# Altium project LoraSMS.PrjPcb
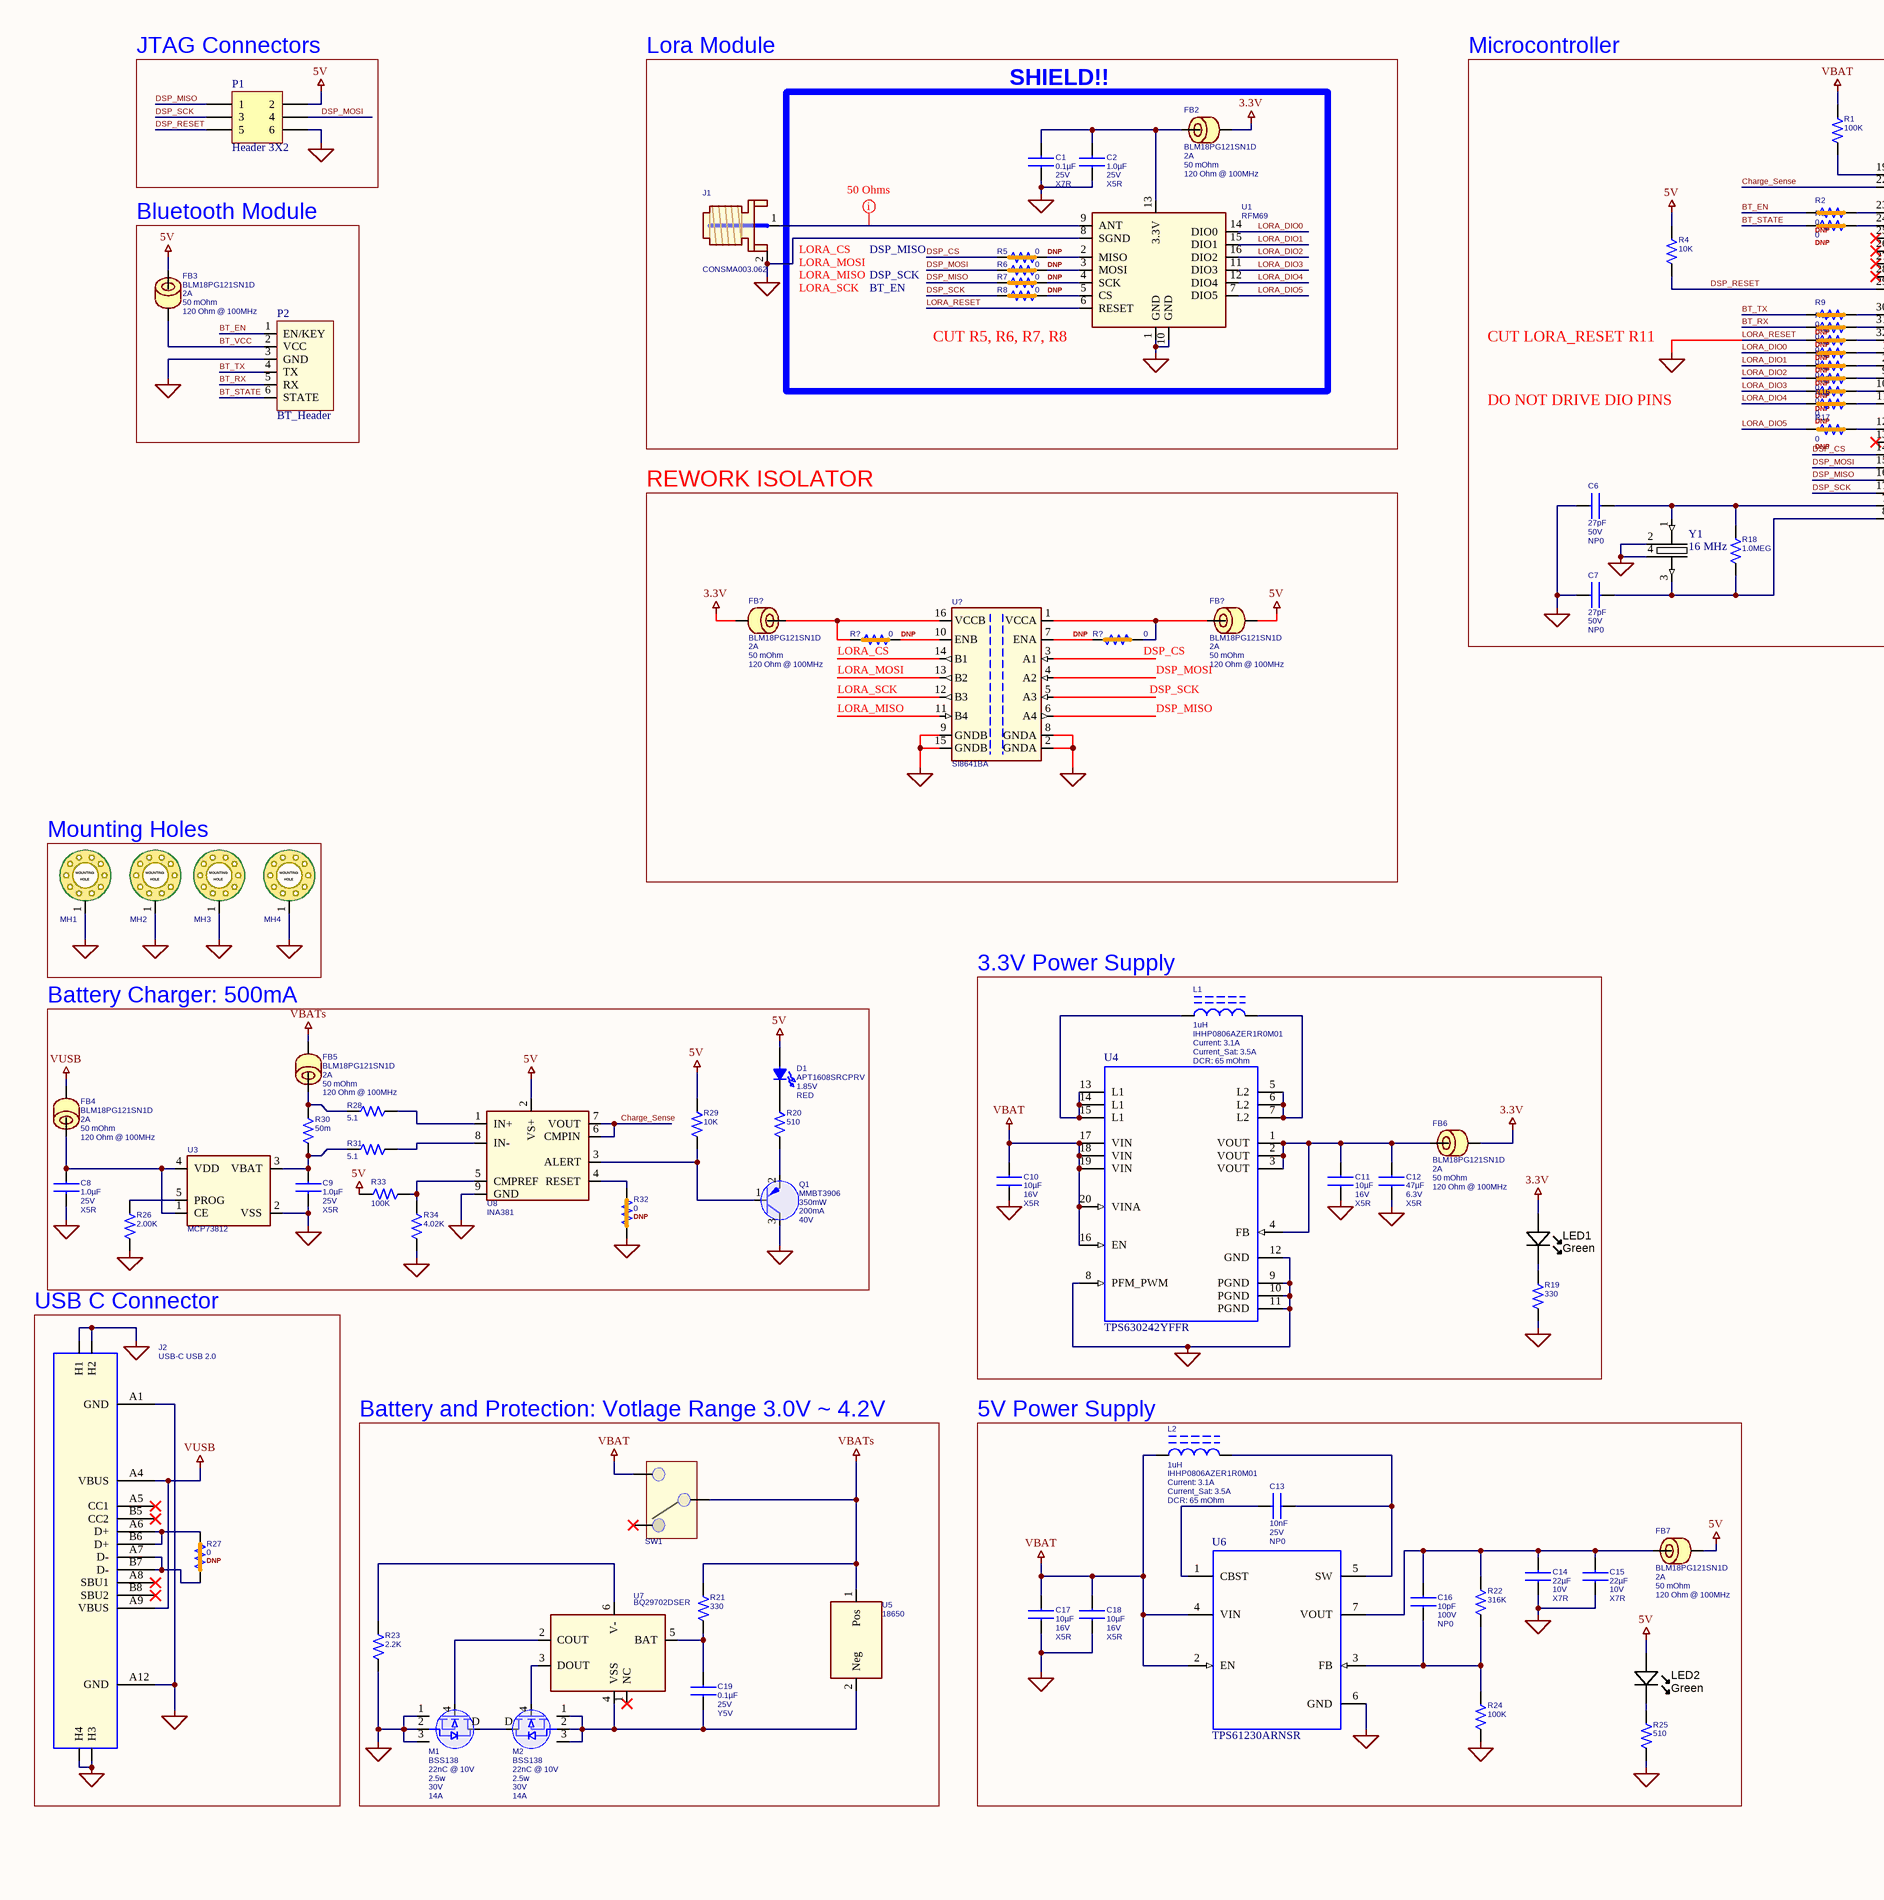
[diagram p0: 01 - Main.SchDoc, left]
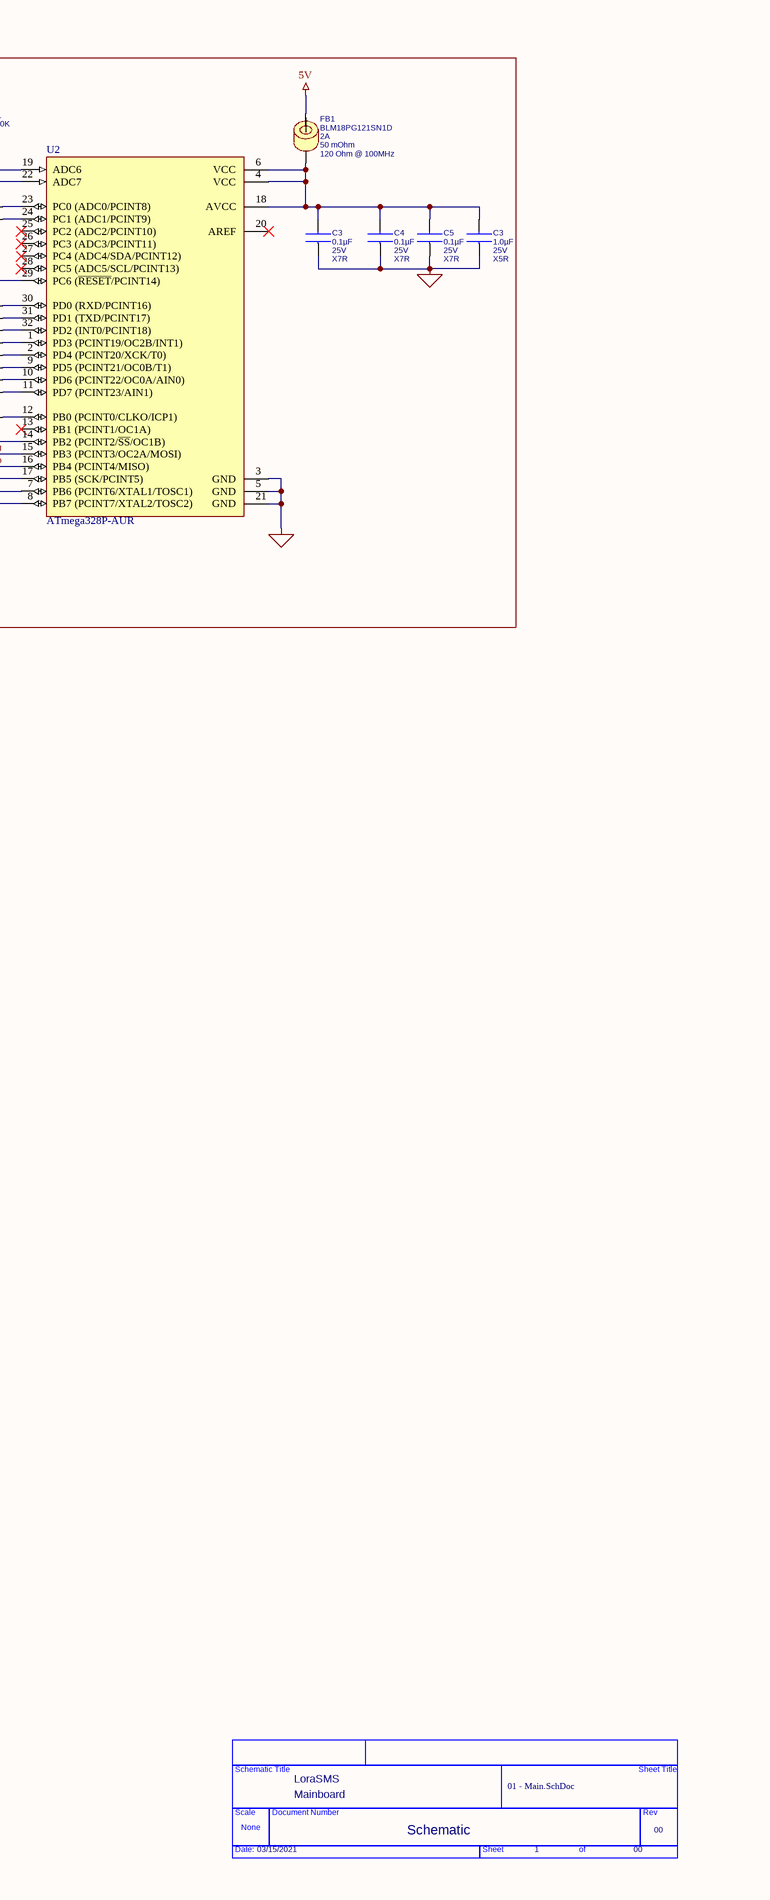
[diagram p1: 01 - Main.SchDoc, right]
prj_par_Project_Name: LoraSMS; prj_par_PCB_Name: Mainboard; prj_par_360_REV: 00; prj_par_360_ReleaseDate: 03/15/2021; prj_par_360_AviPrtNum: 360-XXXXX-XXX(set in Prj Parameters); prj_par_350_REV: 00; prj_par_350_ReleaseDate: 03/15/2021; prj_par_350_AviPrtNum: Fabrication; prj_par_340_REV: 00; prj_par_340_ReleaseDate: 03/15/2021; prj_par_340_AviPrtNum: PCB; prj_par_330_Sheet_Total: 00; prj_par_330_REV: 00; prj_par_330_ReleaseDate: 03/15/2021; prj_par_330_AviPrtNum: Schematic; prj_par_310_REV: 00; prj_par_310_ReleaseDate: 03/15/2021; prj_par_310_AviPrtNum: Assembly
1 sheet, 93 parts. Net scope: flat (ports and power ports of the same name join across sheets).
Board file: LoraSMS.PcbDoc

## Sheet 01 - Main.SchDoc: SetInProjOptions
size 513 x 386 mm; Date: SetInProjOptions; DocumentNumber: SetInProjOptions; Revision: SetInProjOptions; SheetNumber: 1; SheetTotal: SetInProjOptions; CurrentDate: SetInProjOptions; ProjectName: SetInProjOptions

### Parts
(Parts that share a designator on the sheet are numbered #1, #2 ... from top to bottom, then left to right.)
*?  R_E_V: 00  P_C_B_Name: Mainboard  Proj_Name: LoraSMS  SheetTitle: 01 - Main.SchDoc  Page Number: 1  Doc: Schematic  (graphical)
C1  0.1µF  VOLTAGE: 25V  DIELECTRIC: X7R  [CAPC1608X95N]
C2  1.0µF  VOLTAGE: 25V  DIELECTRIC: X5R  [CAPC1608X95N]
C3#1  0.1µF  VOLTAGE: 25V  DIELECTRIC: X7R  [CAPC1608X95N]
C3#2  1.0µF  VOLTAGE: 25V  DIELECTRIC: X5R  [CAPC1608X95N]
C4  0.1µF  VOLTAGE: 25V  DIELECTRIC: X7R  [CAPC1608X95N]
C5  0.1µF  VOLTAGE: 25V  DIELECTRIC: X7R  [CAPC1608X95N]
C6  27pF  VOLTAGE: 50V  DIELECTRIC: NP0  [CAPC1608X95N]
C7  27pF  VOLTAGE: 50V  DIELECTRIC: NP0  [CAPC1608X95N]
C8  1.0µF  VOLTAGE: 25V  DIELECTRIC: X5R  [CAPC1608X95N]
C9  1.0µF  VOLTAGE: 25V  DIELECTRIC: X5R  [CAPC1608X95N]
C10  10µF  VOLTAGE: 16V  DIELECTRIC: X5R  [CAPC2013X140N]
C11  10µF  VOLTAGE: 16V  DIELECTRIC: X5R  [CAPC2013X140N]
C12  47µF  VOLTAGE: 6.3V  DIELECTRIC: X5R  [CAPC2013X140N]
C13  10nF  VOLTAGE: 25V  DIELECTRIC: NP0  [CAPC1608X95N]
C14  22µF  VOLTAGE: 10V  DIELECTRIC: X7R  [CAPC2013X140N]
C15  22µF  VOLTAGE: 10V  DIELECTRIC: X7R  [CAPC2013X140N]
C16  10pF  VOLTAGE: 100V  DIELECTRIC: NP0  [CAPC1608X95N]
C17  10µF  VOLTAGE: 16V  DIELECTRIC: X5R  [CAPC2013X140N]
C18  10µF  VOLTAGE: 16V  DIELECTRIC: X5R  [CAPC2013X140N]
C19  0.1µF  VOLTAGE: 25V  DIELECTRIC: Y5V  [CAPC1608X95N]
D1  APT1608SRCPRV  Vf: 1.85V  LED_COLOR: RED  [LEDM1608X90N]
FB1  BLM18PG121SN1D  Current: 2A  DCR: 50 mOhm  Impedance: 120 Ohm @ 100MHz  [INDC1608X95N]
FB2  BLM18PG121SN1D  Current: 2A  DCR: 50 mOhm  Impedance: 120 Ohm @ 100MHz  [INDC1608X95N]
FB3  BLM18PG121SN1D  Current: 2A  DCR: 50 mOhm  Impedance: 120 Ohm @ 100MHz  [INDC1608X95N]
FB4  BLM18PG121SN1D  Current: 2A  DCR: 50 mOhm  Impedance: 120 Ohm @ 100MHz  [INDC1608X95N]
FB5  BLM18PG121SN1D  Current: 2A  DCR: 50 mOhm  Impedance: 120 Ohm @ 100MHz  [INDC1608X95N]
FB6  BLM18PG121SN1D  Current: 2A  DCR: 50 mOhm  Impedance: 120 Ohm @ 100MHz  [INDC1608X95N]
FB7  BLM18PG121SN1D  Current: 2A  DCR: 50 mOhm  Impedance: 120 Ohm @ 100MHz  [INDC1608X95N]
FB?#1  BLM18PG121SN1D  Current: 2A  DCR: 50 mOhm  Impedance: 120 Ohm @ 100MHz  [INDC1608X95N]
FB?#2  BLM18PG121SN1D  Current: 2A  DCR: 50 mOhm  Impedance: 120 Ohm @ 100MHz  [INDC1608X95N]
J1  CONSMA003.062  [LINX_CONSMA003.062]
J2  USB-C USB 2.0  [GCT_USB4110-GF-A]
L1  1uH  Manufacturer P/N: IHHP0806AZER1R0M01  Current: 3.1A  Current_Sat: 3.5A  DCR: 65 mOhm  [INDC2016X10N]
L2  1uH  Manufacturer P/N: IHHP0806AZER1R0M01  Current: 3.1A  Current_Sat: 3.5A  DCR: 65 mOhm  [INDC2016X10N]
LED1  Green  [LED-0603-GREEN]
LED2  Green  [LED-0603-GREEN]
M1  BSS138  Qg: 22nC @ 10V  Wattage: 2.5w  Vdss: 30V  Id: 14A  [VISHAY_POWERPAK-SO-8-SINGLE]
M2  BSS138  Qg: 22nC @ 10V  Wattage: 2.5w  Vdss: 30V  Id: 14A  [VISHAY_POWERPAK-SO-8-SINGLE]
MH1  MOUNTING HOLE  [MHOLE-120-280]  (value not drawn)
MH2  MOUNTING HOLE  [MHOLE-120-280]  (value not drawn)
MH3  MOUNTING HOLE  [MHOLE-120-280]  (value not drawn)
MH4  MOUNTING HOLE  [MHOLE-120-280]  (value not drawn)
P1  Header 3X2  [HDR2X3]
P2  BT_Header  [BT_MODULE]
Q1  MMBT3906  Wattage: 350mW  Current: 200mA  Voltage: 40V  [SOT95P240X115-3N]
R1  100K  [RESC1608X84N]
R2  0  Do Not Populate: DNP  [RESC1005X40N_SHORT]  (net tie)
R3  0  Do Not Populate: DNP  [RESC1005X40N_SHORT]  (net tie)
R4  10K  [RESC1608X84N]
R5  0  Do Not Populate: DNP  [RESC1005X40N_SHORT]  (net tie)
R6  0  Do Not Populate: DNP  [RESC1005X40N_SHORT]  (net tie)
R7  0  Do Not Populate: DNP  [RESC1005X40N_SHORT]  (net tie)
R8  0  Do Not Populate: DNP  [RESC1005X40N_SHORT]  (net tie)
R9  0  Do Not Populate: DNP  [RESC1005X40N_SHORT]  (net tie)
R10  0  Do Not Populate: DNP  [RESC1005X40N_SHORT]  (net tie)
R11  0  Do Not Populate: DNP  [RESC1005X40N_SHORT]  (net tie)
R12  0  Do Not Populate: DNP  [RESC1005X40N_SHORT]  (net tie)
R13  0  Do Not Populate: DNP  [RESC1005X40N_SHORT]  (net tie)
R14  0  Do Not Populate: DNP  [RESC1005X40N_SHORT]  (net tie)
R15  0  Do Not Populate: DNP  [RESC1005X40N_SHORT]  (net tie)
R16  0  Do Not Populate: DNP  [RESC1005X40N_SHORT]  (net tie)
R17  0  Do Not Populate: DNP  [RESC1005X40N_SHORT]  (net tie)
R18  1.0MEG  [RESC1608X84N]
R19  330  [RESC2013X84N]
R20  510  [RESC1608X84N]
R21  330  [RESC1608X84N]
R22  316K  [RESC1608X84N]
R23  2.2K  [RESC1608X84N]
R24  100K  [RESC1608X84N]
R25  510  [RESC1608X84N]
R26  2.00K  [RESC1608X84N]
R27  0  Do Not Populate: DNP  [RESC1005X40N_SHORT]  (net tie)
R28  5.1  [RESC1608X84N]
R29  10K  [RESC1608X84N]
R30  50m  [RESC3216X84N]
R31  5.1  [RESC1608X84N]
R32  0  Do Not Populate: DNP  [RESC1005X40N_SHORT]  (net tie)
R33  100K  [RESC1608X84N]
R34  4.02K  [RESC1608X84N]
R?#1  0  Do Not Populate: DNP  [RESC1005X40N_SHORT]  (net tie)
R?#2  0  Do Not Populate: DNP  [RESC1005X40N_SHORT]  (net tie)
SW1  SWITCH  [JS202011JAQN]  (value not drawn)
U1  RFM69  [RFM69HCW]
U2  ATmega328P-AUR  [32A_N]
U3  MCP73812  [SOT95P280X145-5N]
U4  TPS630242YFFR  [YFF0020AEBA]
U5  18650  [18650]
U6  N/A  [RNS0007A]  (value not drawn)
U7  BQ29702DSER  [SOTFL50P162X60-6N]
U8  INA381  [SON45P200X200X80-9N]
U?  SI8641BA
Y1  16 MHz  [Crystal_2.5x2.0]

### Blocks framed on the sheet
JTAG Connectors: P1
Lora Module: J1
Microcontroller: C3#1 C3#2 C4-C7 FB1 R1-R4 R9-R18 U2 Y1
SHIELD!!: C1 C2 FB2 R5-R8 U1
Bluetooth Module: FB3 P2
REWORK ISOLATOR: FB?#1 FB?#2 R?#1 R?#2 U?
Mounting Holes: MH1-MH4
3.3V Power Supply: C10-C12 FB6 L1 LED1 R19 U4
Battery Charger: 500mA: C8 C9 D1 FB4 FB5 Q1 R20 R26 R28-R34 U3 U8
USB C Connector: J2 R27
Battery and Protection: Votlage Range 3.0V ~ 4.2V: C19 M1 M2 R21 R23 SW1 U5 U7
5V Power Supply: C13-C18 FB7 L2 LED2 R22 R24 R25 U6

### Nets
3.3V: FB2.2 FB6.2 FB?#1.2 LED1.A
5V: D1.A(ANODE) FB1.1 FB3.1 FB7.2 FB?#2.2 LED2.A P1.2 R4.1 R29.1 R33.1 U8.2(VS+)
GND: C1.2 C2.2 C3#1.2 C3#2.2 C4.2 C5.2 C6.1 C7.1 C8.2 C9.2 C10.2 C11.2 C12.2 C14.2 C15.2 C17.2 C18.2 J1.2(SHIELD) J2.A1(GND) J2.A12(GND) J2.H1 J2.H2 J2.H3 J2.H4 M1.1(SOURCE) M1.2(SOURCE) M1.3(SOURCE) MH1.1 MH2.1 MH3.1 MH4.1 P1.6 P2.3(GND) Q1.3(C) R19.2 R23.2 R24.2 R25.2 R26.2 R32.1 R34.2 U1.1(GND) U1.8(SGND) U1.10(GND) U2.3(GND) U2.5(GND) U2.21(GND) U3.2(VSS) U4.8(PFM_PWM) U4.9(PGND) U4.10(PGND) U4.11(PGND) U4.12(GND) U6.6(GND) U8.9(GND) U?.2(GNDA) U?.8(GNDA) U?.9(GNDB) U?.15(GNDB) Y1.2(GND) Y1.4(GND)
VBAT: C10.1 C17.1 C18.1 L2.1 R1.1 SW1.1 U4.16(EN) U4.17(VIN) U4.18(VIN) U4.19(VIN) U4.20(VINA) U6.2(EN) U6.4(VIN)
VBATs: FB5.2 R21.1 SW1.2 U5.1(Pos)
VUSB: FB4.2 J2.A4(VBUS) J2.A9(VBUS)
BT_EN: P2.1(EN/KEY) R2.1
BT_RX: P2.5(RX) R10.1
BT_STATE: P2.6(STATE) R3.1
BT_TX: P2.4(TX) R9.1
BT_VCC: FB3.2 P2.2(VCC)
Charge_Sense: U2.22(ADC7) U8.6(CMPIN) U8.7(VOUT)
DSP_CS: R5.1 U2.14(PB2_(PCINT2/~{SS}/OC1B))
DSP_MISO: P1.1 R7.1 U2.16(PB4_(PCINT4/MISO))
DSP_MOSI: P1.4 R6.1 U2.15(PB3_(PCINT3/OC2A/MOSI))
DSP_RESET: P1.5 R4.2 U2.29(PC6_(~{RESET}/PCINT14))
DSP_SCK: P1.3 R8.1 U2.17(PB5_(SCK/PCINT5))
LORA_DIO0: R12.1 U1.14(DIO0)
LORA_DIO1: R13.1 U1.15(DIO1)
LORA_DIO2: R14.1 U1.16(DIO2)
LORA_DIO3: R15.1 U1.11(DIO3)
LORA_DIO4: R16.1 U1.12(DIO4)
LORA_DIO5: R17.1 U1.7(DIO5)
LORA_RESET: R11.1 U1.6(RESET)
NetC1_1: C1.1 C2.1 FB2.1 U1.13(3.3V)
NetC3#1_1: C3#1.1 C3#2.1 C4.1 C5.1 FB1.2 U2.4(VCC) U2.6(VCC) U2.18(AVCC)
NetC6_2: C6.2 R18.1 U2.7(PB6_(PCINT6/XTAL1/TOSC1)) Y1.1
NetC7_2: C7.2 R18.2 U2.8(PB7_(PCINT7/XTAL2/TOSC2)) Y1.3
NetC8_1: C8.1 FB4.1 U3.1(CE) U3.4(VDD)
NetC9_1: C9.1 R30.2 R31.1 U3.3(VBAT)
NetC11_1: C11.1 C12.1 FB6.1 U4.1(VOUT) U4.2(VOUT) U4.3(VOUT) U4.4(FB)
NetC13_1: C13.1 U6.1(CBST)
NetC13_2: C13.2 L2.2 U6.5(SW)
NetC14_1: C14.1 C15.1 C16.1 FB7.1 R22.1 U6.7(VOUT)
NetC16_2: C16.2 R22.2 R24.1 U6.3(FB)
NetC19_1: C19.1 R21.2 U7.5(BAT)
NetC19_2: C19.2 M2.1(SOURCE) M2.2(SOURCE) M2.3(SOURCE) U5.2(Neg) U7.4(VSS)
NetD1_C: D1.C(CATHODE) R20.1
NetFB5_1: FB5.1 R28.1 R30.1
NetFB?#1_1: FB?#1.1 R?#1.1 U?.16(VCCB)
NetFB?#2_1: FB?#2.1 R?#2.1 U?.1(VCCA)
NetJ1_1: J1.1(CENTER) U1.9(ANT)
NetJ2_A6: J2.A6(D+) J2.B6(D+) R27.2
NetJ2_A7: J2.A7(D-) J2.B7(D-) R27.1
NetL1_1: L1.1 U4.13(L1) U4.14(L1) U4.15(L1)
NetL1_2: L1.2 U4.5(L2) U4.6(L2) U4.7(L2)
NetLED1_K: LED1.K R19.1
NetLED2_K: LED2.K R25.1
NetM1_4: M1.4(GATE) U7.2(COUT)
NetM1_D: M1.D(DRAIN) M2.D(DRAIN)
NetM2_4: M2.4(GATE) U7.3(DOUT)
NetQ1_1: Q1.1(B) R29.2 U8.3(ALERT)
NetQ1_2: Q1.2(E) R20.2
NetR1_2: R1.2 U2.19(ADC6)
NetR2_2: R2.2 U2.23(PC0_(ADC0/PCINT8))
NetR3_2: R3.2 U2.24(PC1_(ADC1/PCINT9))
NetR5_2: R5.2 U1.2(MISO)
NetR6_2: R6.2 U1.3(MOSI)
NetR7_2: R7.2 U1.4(SCK)
NetR8_2: R8.2 U1.5(CS)
NetR9_2: R9.2 U2.30(PD0_(RXD/PCINT16))
NetR10_2: R10.2 U2.31(PD1_(TXD/PCINT17))
NetR11_2: R11.2 U2.32(PD2_(INT0/PCINT18))
NetR12_2: R12.2 U2.1(PD3_(PCINT19/OC2B/INT1))
NetR13_2: R13.2 U2.2(PD4_(PCINT20/XCK/T0))
NetR14_2: R14.2 U2.9(PD5_(PCINT21/OC0B/T1))
NetR15_2: R15.2 U2.10(PD6_(PCINT22/OC0A/AIN0))
NetR16_2: R16.2 U2.11(PD7_(PCINT23/AIN1))
NetR17_2: R17.2 U2.12(PB0_(PCINT0/CLKO/ICP1))
NetR23_1: R23.1 U7.6(V-)
NetR26_1: R26.1 U3.5(PROG)
NetR28_2: R28.2 U8.1(IN+)
NetR31_2: R31.2 U8.8(IN-)
NetR32_2: R32.2 U8.4(RESET)
NetR33_2: R33.2 R34.1 U8.5(CMPREF)
NetR?#1_2: R?#1.2 U?.10(ENB)
NetR?#2_2: R?#2.2 U?.7(ENA)

Not connected (* = marked no-connect by the designer): J2 A5(CC1)* A8(SBU1)* B5(CC2)* B8(SBU2)*; SW1 3*; U2 13(PB1_(PCINT1/OC1A))* 20(AREF)* 25(PC2_(ADC2/PCINT10))* 26(PC3_(ADC3/PCINT11))* 27(PC4_(ADC4/SDA/PCINT12))* 28(PC5_(ADC5/SCL/PCINT13))*; U7 1(NC)*; U? 3(A1) 4(A2) 5(A3) 6(A4) 11(B4) 12(B3) 13(B2) 14(B1)

### Layout directives
net class 50 Ohms: NetJ1_1

### Notes on the sheet
- (near J1) LORA_MOSI
- (near J1) LORA_MISO
- (near J1) LORA_SCK
- (near J1) LORA_CS
- DSP_MISO
- DSP_SCK
- BT_EN
- (near U1) CUT R5, R6, R7, R8
- CUT LORA_RESET R11
- DO NOT DRIVE DIO PINS
- (near R?#1) LORA_MOSI
- (near R?#1) LORA_CS
- (near R?#2) DSP_CS
- (near R?#2) DSP_MOSI
- LORA_MISO
- LORA_SCK
- Labels drawn without touching a wire or pin: GND
- (in symbol Fox_PrjLvl_TitleBlock) Schematic Title; Sheet Title; Scale; Document Number; Rev; None; Date:; Sheet; of
- (in symbol MHOLE-120-280) MOUNTING; HOLE

### Library data of the parts
*? = Fox_PrjLvl_TitleBlock: Page Create Date: May 8, 2017; Page Count: 00
C1 C3#1 C4 C5 = 060-00124-000: CAP, CER, SMT, 25V, +/- 10%, X7R, 0603; Manufacturer: Kemet Corporation; Manufacturer P/N: C0603C104K3RAC; Value (nF): 100; Value (pF): 100000; Value (µF): 0.1; Package: C0603; TOLERANCE: 10%; Value: 0.1µF; Cost: 0.0043
C2 C3#2 C8 C9 = 060-00192-001: CAP, CER, SMT, 1.0UF, 25V, 10%, X5R, 0603; Manufacturer: Kemet Corporation; Manufacturer P/N: C0603C105K3PAC; Value (nF): 1000; Value (pF): 1000000; Value (µF): 1; Package: C0603; TOLERANCE: 10%; Value: 1.0µF; Cost: 0.0145
C6 C7 = 060-00139-005: CAP, CER, 10%, 50V, 27PF, CAP0603; Manufacturer: Kemet Corporation; Manufacturer P/N: C0603C270K5GAC; Value (nF): 0.027; Value (pF): 27; Value (µF): 0.000027; Package: C0603; TOLERANCE: 10%; Value: 27pF; Cost: 0.01
C10 C11 C17 C18 = 060-00196-000: CAP, CER, 10UF, 16V, X5R, 0805; Manufacturer: Murata Manufacturing Co., Ltd.; Manufacturer P/N: GRM21BR61C106KE15L; TOLERANCE: 10%; Value (nF): 10000; Value (pF): 10000000; Value (µF): 10; Package: C0805; Value: 10µF; Cost: 0.0373
C12 = 060-00269-000: CAP, CER, 0805, 20%, 6.3V, X5R, 47UF; Manufacturer: Kemet Corporation; Manufacturer P/N: C0805C476M9PACTU; Value (nF): 47000; Value (pF): 47000000; Value (µF): 47; Package: C0805; TOLERANCE: 20%; Value: 47µF; Cost: 0.164
C13 = 060-00243-000: CAP, CER, 5%, 25V, C0G, 0603, 10,000PF; Manufacturer: TDK Corporation; Manufacturer P/N: C1608C0G1E103JT; Value (nF): 10; Value (pF): 10000; Value (µF): 0.01; Package: C0603; TOLERANCE: 5%; Value: 10nF; Cost: 0.2528
C14 C15 = 060-00268-000: CAP, CER, 0805, 20%, 10V, X7R, 22UF; Manufacturer: Taiyo Yuden USA, Inc.; Manufacturer P/N: LMK212BJ226MG-T; Value (nF): 22000; Value (pF): 22000000; Value (µF): 22; Package: C0805; TOLERANCE: 20%; Value: 22µF; Cost: 0.134
C16 = 064-00028-016: CAP RF, HIQ, NPO, +/-1%, 10GHZ, 200, 100V, 0603, 10PF, ROHS; Manufacturer: Vishay; Manufacturer P/N: VJ0603D100FXBA; TOLERANCE: 1%; Value (nF): 0.01; Value (pF): 10; Value (µF): 0.00001; Value: 10pF; Package: C0603; Cost: 0.18353
C19 = 060-00041-000: CAP, CER, SMT, 25V, +80/-20%,Y5V,0603,.1uf; Manufacturer: Kemet Corporation; Manufacturer P/N: C0603C104M3VAC; TOLERANCE: 20%; Value (nF): 100; Value (pF): 100000; Value (µF): 0.1; Package: C0603; Value: 0.1µF
D1 = 023-00316-000: DIODE, LED, RED, SMT, 2.5V, 0603; Manufacturer: Kingbright; Candela: 100mcd; Wattage: 75mW; Wavelength: 640nm; Current: 20mA; Manufacturer P/N: APT1608SRCPRV; Package: D0603; Value: APT1608SRCPRV; Type: LED; Voltage: 2.5V; Cost: 0.04
FB1-FB7 FB?#1 FB?#2 = 082-00014-004: FERRITE,100MHZ,0603,25%,120OHM ROHS; Manufacturer: Murata; Manufacturer P/N: BLM18PG121SN1D; Value: BLM18PG121SN1D; Package: L0603; Cost: 0.0172
J1 = 030-00761-000: CONN, SMA JACK, FEMALE, EDGE; Manufacturer: LINX; Manufacturer P/N: CONSMA003.062; Value: CONSMA003.062; Package: SMA; Cost: 3.37
J2 = USB4110-GF-A: CONN USB 2.0 TYPE-C R/A SMT; Manufacturer: GCT; Contacts: 24; Manufacturer P/N: USB4110-GF-A; Value: USB-C USB 2.0; Cost: 1.37; Pitch: *; Rows: *; Type: Female
L1 L2 = 080-00223-000: INDUCTOR POWER 1UH 1.5A SMD; Manufacturer: Vishay Dale; TOLERANCE: 20%; Value: 1uH; Package: 0.079" L x 0.063" W; Cost: 0.13
LED1 LED2 = LED_SMD_Green_0603_570nm: LED 0603 SMD Green 570nm 50mcd 20mA; Manufacturer 1: Kingbright Company LLC; Manufacturer Part Number 1: APT1608CGCK; Manufacturer: Wurth Electronics; Manufacturer P/N: 150060VS75000; Material: AlGaInP; Ratings: 20mcd min; 50 mcd typ; 570 nm; Voltage - Forward (Vf) Typ: 2.1V; Viewing Angle: 120°; Lens Style/Size: Rectangle with Flat Top, 1.1mm x 0.8mm; Voltage - Forward (Vf) @ 10mA: 2.0V; SCDType: source; Wavelength - Peak: 574nm; Lens Type: Clear; Package / Case: 0603 (1608 metric); Color: Green; Current - Test: 20mA; Supplier 1: Digi-Key; Supplier Part Number 1: 754-1116-1-ND; RoHS 1: RoHS Compliant; Wavelength - Dominant: 570nm; ComponentLink1URL: http://www.us.kingbright.com/images/catalog/SPEC/APT1608CGCK.pdf; ComponentLink1Description: http://www.us.kingbright.com/images/catalog/SPEC/APT1608CGCK.pdf
M1 M2 = FDMS7692: MOSFET N-CH 30V 14A POWER56; Manufacturer: ON Semiconductor; Rds(on): 7.5 Ohm; Vgs(th): 3V @ 250UA; Manufacturer P/N: FDMS7692; Value: BSS138; Type: NMOS; Cost: 0.62
MH1-MH4 = MHOLE-120-280: Value: MOUNTING HOLE
P1 = Header 3X2: Header, 3-Pin, Dual row; LatestRevisionDate: 17-Jul-2002; LatestRevisionNote: Re-released for DXP Platform.; Publisher: Altium Limited
P2 = BT_Header: HC-05 BLUETOOTH MODULE
Q1 = 025-00001-000: TRANS,BJT,PNP,3906,SOT-23; Manufacturer: Fairchild Semiconductor; Gain: 100 @ 10mA; Package: SOT-23; Value: MMBT3906; Manufacturer P/N: MMBT3906; Type: PNP; Cost: 0.012
R1 R24 = 070-00486-037: RES, THICK FILM CHIP, SMT, 1/10W, 1%, 0603, 100K OHM; Manufacturer: Panasonic Electronic Devices, Corp.; Manufacturer P/N: ERJ3EKF1003V; TOLERANCE: 1%; Value: 100K; Wattage: 1/10W; Package: R0603; Cost: 0.0016
R2 R3 R5-R17 R27 R32 R?#1 R?#2 = 070-00475-085_SHORT: RES, THICK FILM CHIP, 1/16W, 1%, RES0402, 0 OHM, ROHS, SHORT-IN-PAD!; Manufacturer: Vishay-Dale Intertechnology, Inc; Manufacturer P/N: CRCW04020000Z0ED; TOLERANCE: 1%; Value: 0; Wattage: 1/16W; Package: R0402; Cost: 0.0012
R4 R29 = 070-00470-014: RES, THICK FILM CHIP, SMT, 1/10W, 5%, 0603, 10K OHM; Manufacturer: Vishay-Dale Intertechnology, Inc; Manufacturer P/N: CRCW060310K0JNEA; TOLERANCE: 5%; Value: 10K; Wattage: 1/10W; Package: R0603
R18 = 070-00305-000: RES, 1/10W, 5%, 0603, I MEG; Manufacturer: KOA-Speer Electronics, Inc.; Manufacturer P/N: RM73B1JT105J; TOLERANCE: 5%; Value: 1.0MEG; Wattage: 1/10W; Package: R0603
R19 = 070-00072-000: RES, 1/8W, 5%, 0805, 330 OHM; Manufacturer: KOA-Speer Electronics, Inc.; Manufacturer P/N: RM73B2AT331J; TOLERANCE: 5%; Value: 330; Wattage: 1/8W; Package: R0805; Cost: 0.0019
R20 R25 = 070-00470-011: RES, THICK FILM CHIP, SMT, 1/10W, 5%, 0603, 510 OHM; Manufacturer: Panasonic Electronic Devices, Corp.; Manufacturer P/N: ERJ3GEYJ511V; TOLERANCE: 5%; Value: 510; Wattage: 1/10W; Package: R0603
R21 = 070-00442-000: RES, 1/16 W, 1%, 0603, 330 OHM; Manufacturer: Panasonic Electronic Devices, Corp.; Manufacturer P/N: ERJ-3ENF3300V; Wattage: 1/10W; TOLERANCE: 1%; Value: 330; Package: R0603
R22 = 070-00486-071: RES, THICK FILM CHIP, SMT, 1/10W, 1%, 0603, 316K OHM; Manufacturer: Panasonic Electronic Devices, Corp.; Manufacturer P/N: ERJ3EKF3163V; TOLERANCE: 1%; Value: 316K; Wattage: 1/10W; Package: R0603; Cost: 0.0016
R23 = 070-00208-000: RES, 1/10W, 5%, 0603, 2.2K OHM; Manufacturer: KOA-Speer Electronics, Inc.; Manufacturer P/N: RM73B1JT222J; TOLERANCE: 5%; Value: 2.2K; Wattage: 1/10W; Package: R0603; Cost: 0.0012
R26 = 070-00415-000: RES, 1/16W, 1%, 0603, 2.00K OHM; Manufacturer: Panasonic Electronic Devices, Corp.; Manufacturer P/N: ERJ-3EKF2001V; TOLERANCE: 1%; Value: 2.00K; Wattage: 1/16W; Package: R0603; Cost: 0.0032
R28 R31 = 070-00486-069: RES, THICK FILM CHIP, SMT, 1/10W, 1%, 0603, 5.1 OHM; Manufacturer: Panasonic Electronic Devices, Corp.; Manufacturer P/N: ERJ-3EKF5R1V; TOLERANCE: 1%; Value: 5.1; Wattage: 1/10W; Package: R0603
R30 = 070-00499-001: RES, THICK FILM, CURRENT SENSE, 1/2 W, 1%, RES1206, 0.05 OHMS; Manufacturer: TT Electronics, PLC; Manufacturer P/N: LRC-LR1206LF-01-R050-F; Wattage: 1/2W; TOLERANCE: 1%; Value: 50m; Package: R1206; Cost: 0.155
R33 = 070-00113-000: RES,1/10W,1%,0603,100K OHM; Manufacturer: Panasonic Electronic Devices, Corp.; Manufacturer P/N: ERJ-3EKF1003V; TOLERANCE: 1%; Value: 100K; Wattage: 1/10W; Package: R0603; Cost: 0.002
R34 = 070-00597-000: RES, METAL FILM, 1/16W, .5%, 0603, SMD, 4.02K; Manufacturer: Susumu; Manufacturer P/N: RR0816P-4021-D-59H; TOLERANCE: 1%; Value: 4.02K; Wattage: 1/16W; Package: R0603; Cost: 0.01178
SW1 = JS202011JAQN: SWITCH SLIDE DPDT 300MA 6V; Manufacturer P/N: C&K; Manufacturer: JS202011JAQN; Cost: 0.51
U1 = LoRa Module: RFM69HCW WIRELESS TRANSCEIVER 91; Manufacturer P/N: COM-13909; Manufacturer: SparkFun; Current: 130mA; Voltage-Input: 1.8V ~ 3.6V; Package: Module; Value: RFM69; Cost: 5.95
U2 = ATmega328P-AUR: 8-bit AVR Microcontroller, 32KB Flash, 1KB EEPROM, 2KB SRAM, 32-pin TQFP, Industrial Grade (-40°C to 85°C); Manufacturer: Microchip Technology; Manufacturer P/N: ATMEGA328PB-AU; Published: 1-Apr-2010; DatasheetVersion: revA, Jan-2010; PackageVersion: revB, Oct-2001; PackageReference: 32A; Publisher: Altium Limited; PackageDescription: 32-Lead, 7x7x1.0 mm Body, 0.8mm Lead Pitch, Thin Profile Plastic Quad Flat Package (TQFP); Supplier 1: Digi-Key; Supplier Part Number 1: ATMEGA328P-AUR-ND; Supplier 2: Mouser; Supplier Part Number 2: 556-ATMEGA328P-AUR; Code_JEDEC: MS-026-ABA; ComponentLink1Description: Manufacturer Link; ComponentLink1URL: http://www.atmel.com/products/avr/default.asp?; ComponentLink2Description: ATmega48A/48PA/88A/88PA/168A/168PA/328/328P Datasheet; ComponentLink2URL: http://www.atmel.com/dyn/resources/prod_documents/8271.pdf; ComponentLink3Description: ATmega48A/48PA/88A/88PA/168A/168PA/328/328P Summary; ComponentLink3URL: http://www.atmel.com/dyn/resources/prod_documents/8271S.pdf; ComponentLink4Description: Atmel.com Home; ComponentLink4URL: http://www.atmel.com
U3 = MCP73812: IC LI-ION/LI-POLY CTRLR SOT23-5; Manufacturer P/N: MCP73812T-420I/OT; Manufacturer: Microchip Technology; Current: 500mA; Voltage-Input: 3.75V ~ 6V; Package: SC-74A, SOT-753; Value: MCP73812; Cost: 0.56
U4 = TPS630242YFFR: Manufacturer Name: Texas Instruments; Manufacturer: TI; PackageReference: TPS630242YFFR; Manufacturer Part Number: TPS630242YFFR; Value: N/A; Manufacturer P/N: TPS630242YFFR
U5 = 1042: HOLDER BATTERY 1CELL 18650 SMD; Manufacturer: Keystone Electronics; Manufacturer P/N: 1042; Value: 18650; Cost: 2.47
U6 = TPS61230ARNSR: Manufacturer Name: Texas Instruments; Manufacturer: TI; Value: N/A; Manufacturer Part Number: TPS61230ARNSR; PackageReference: TPS61230ARNSR; Manufacturer P/N: TPS61230ARNSR
U7 = BQ29702DSER: IC LITHIUM BATT PROTECT 6-SON; Manufacturer: Texas instruments; Manufacturer P/N: BQ29702DSER; Value: BQ29702DSER; Cost: 0.69
U8 = INA381A3IDSGR: LOW COST CURRENT SENSOR WITH COM; Manufacturer: TI; Voltage-Input: 0V ~ 6V; Manufacturer P/N: INA381A3IDSGR; Package: 8-WFDFN Exposed Pad; Value: INA381; Cost: .75
U? = SI8641BA-B-IU: DGTL ISO 3KV GEN PRP 8SOIC; Manufacturer: Silicon Labs; Voltage-Input: 2.25 V ~ 5.5 V; Manufacturer P/N: SI8641BA-B-IU; Value: SI8641BA; Cost: 1.64; Package: 16-SSOP (0.154", 3.90mm Width)
Y1 = FA-20H: CRYSTAL 16.0000MHZ 8PF SMD; Manufacture PN: FA-20H 16.0000MF10Z-AJ0; Manufacture: EPSON; Voltage: 2.7V - 3.6V; Frequency Stability: 10 ppm; Value: 16 MHz; Frequency: 16 MHz; Cost: 0.69; Package: 0.098" L x 0.079" W (2.50mm x 2.00mm)

## Assembly variants
DoNotPopulate: all parts fitted